# Altium schematic sheet 3_wiring drawing.SchDoc: IGON & KL15
size A2; ApprovedBy: Approved By; CheckedBy: Sky Ma; DrawnBy: JACK; Address1: 1; Address2: 2; Address3: 3; Address4: 4; DocumentNumber: 04-TE-42-4015-0PA-A; Revision: B; SheetNumber: 4; SheetTotal: 6; SheetSize: A2; CheckedByDate: 2022-12-5; DrawByDate: 2022-12-5; SiteName: EMS TD Huangpu; ProjectName: 19205_BMW CCU DDR PCBA FT fixture wiring
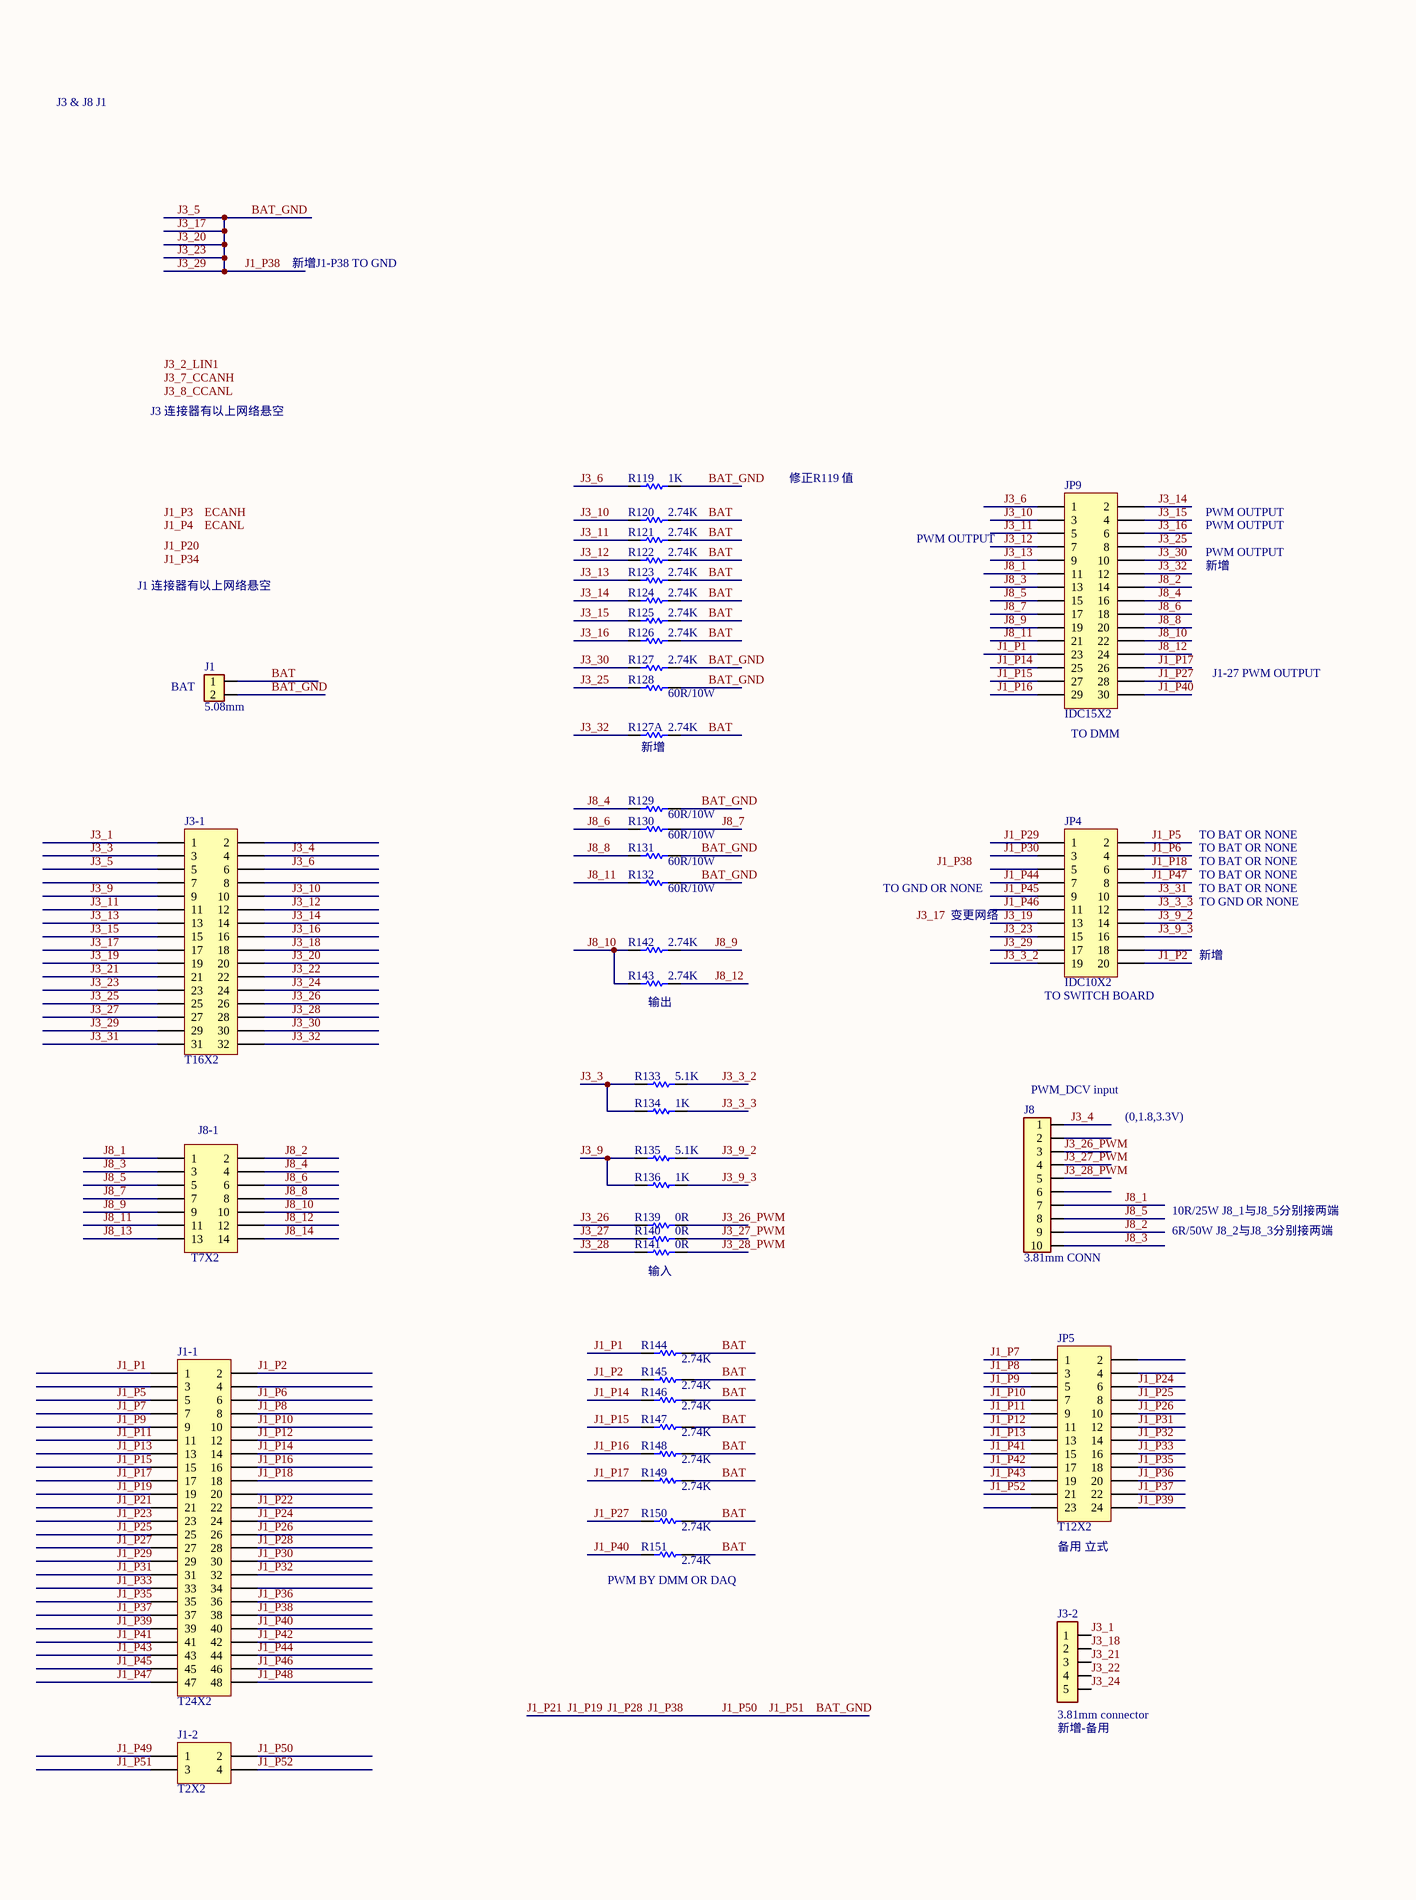
[diagram p0: 3_wiring drawing.SchDoc, left]
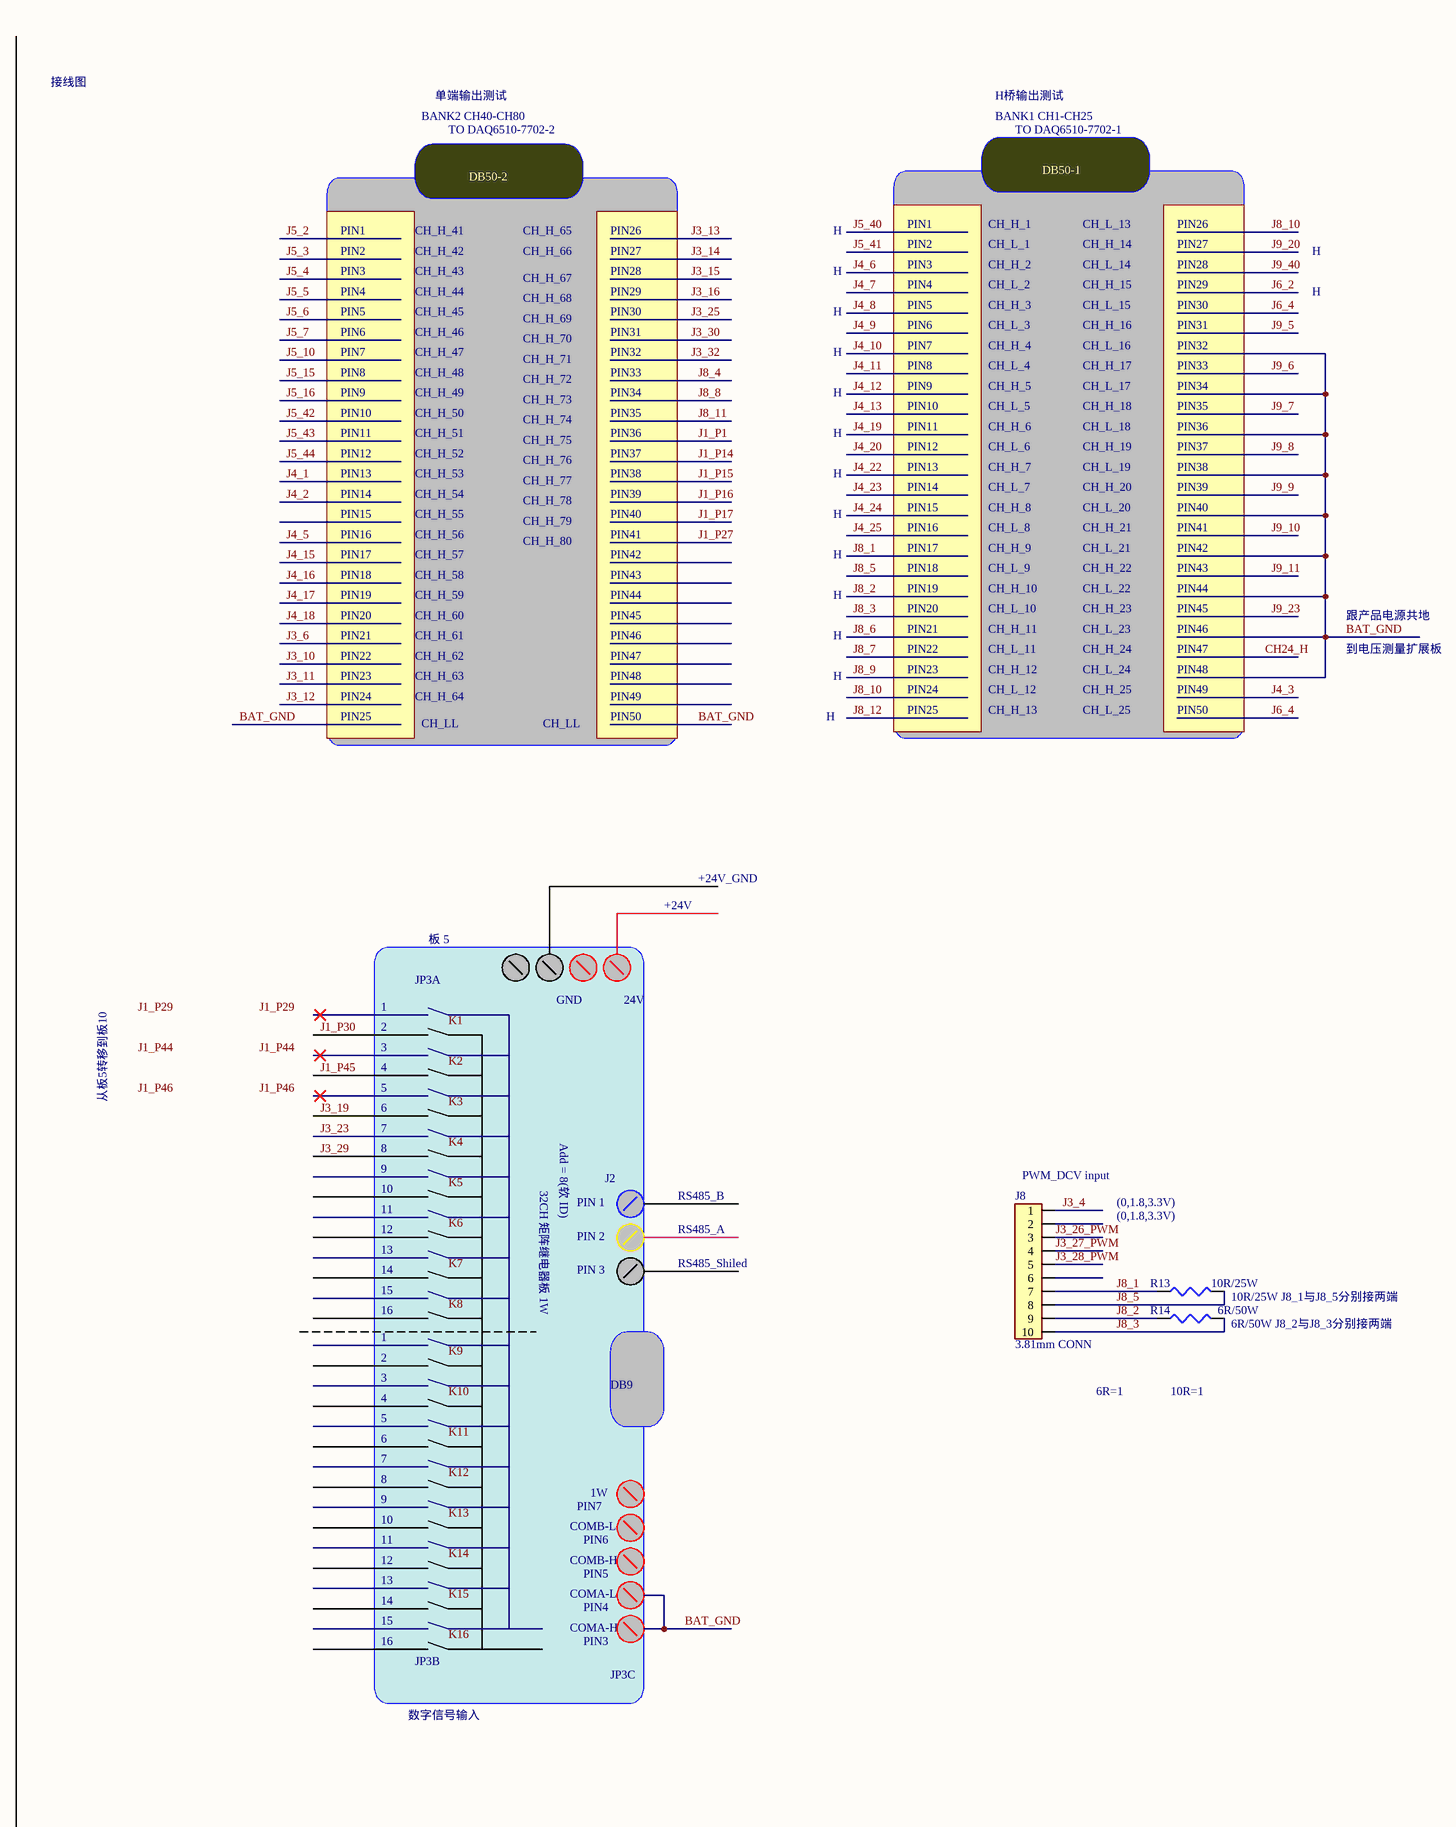
[diagram p1: 3_wiring drawing.SchDoc, right]

## Parts
(Parts that share a designator on the sheet are numbered #1, #2 ... from top to bottom, then left to right.)
J1  5.08mm  [3.81mm-2]
J1-1  T24X2  [T24X2-bend]
J1-2  T2X2  [T2X2-bend]
J3-1  T16X2  [T16X2-bend]
J3-2  3.81mm connector  [3.81mm-5-Bend]
J8#1  3.81mm CONN  [3.81mm-10]
J8#2  3.81mm CONN  [3.81mm-10]
J8-1  T7X2  [T7X2-bend]
JP4  IDC10X2  [IDC20]
JP5  T12X2  [T12X2-bend]
JP9  IDC15X2  [IDC30]
R13  10R/25W  [R AXIAL0.4]
R14  6R/50W  [R AXIAL0.4]
R119  1K  [AXIAL-0.25W]
R120  2.74K  [AXIAL-0.25W]
R121  2.74K  [AXIAL-0.25W]
R122  2.74K  [AXIAL-0.25W]
R123  2.74K  [AXIAL-0.25W]
R124  2.74K  [AXIAL-0.25W]
R125  2.74K  [AXIAL-0.25W]
R126  2.74K  [AXIAL-0.25W]
R127  2.74K  [AXIAL-0.25W]
R127A  2.74K  [AXIAL-0.25W]
R128  60R/10W  [立式10W]
R129  60R/10W  [立式10W]
R130  60R/10W  [立式10W]
R131  60R/10W  [立式10W]
R132  60R/10W  [立式10W]
R133  5.1K  [AXIAL-0.25W]
R134  1K  [AXIAL-0.25W]
R135  5.1K  [AXIAL-0.25W]
R136  1K  [AXIAL-0.25W]
R139  0R  [AXIAL-0.25W]
R140  0R  [AXIAL-0.25W]
R141  0R  [AXIAL-0.25W]
R142  2.74K  [AXIAL-0.25W]
R143  2.74K  [AXIAL-0.25W]
R144  2.74K  [AXIAL-0.25W]
R145  2.74K  [AXIAL-0.25W]
R146  2.74K  [AXIAL-0.25W]
R147  2.74K  [AXIAL-0.25W]
R148  2.74K  [AXIAL-0.25W]
R149  2.74K  [AXIAL-0.25W]
R150  2.74K  [AXIAL-0.25W]
R151  2.74K  [AXIAL-0.25W]

## Nets
BAT: J1.1 R120.2 R121.2 R122.2 R123.2 R124.2 R125.2 R126.2 R127A.2 R144.2 R145.2 R146.2 R147.2 R148.2 R149.2 R150.2 R151.2
BAT_GND: J1.2 J1-1.19 J1-1.21 J1-1.28 J1-1.38 J1-2.2 J1-2.3 J3-1.5 J3-1.17 J3-1.20 J3-1.23 J3-1.29 JP4.15 JP4.17 R119.2 R127.2 R128.2 R129.2 R131.2 R132.2  [also labelled J1_P19, J1_P21, J1_P28, J1_P38, J1_P50, J1_P51, J3_17, J3_20, J3_23, J3_29, J3_5]
J1_P1: J1-1.1 JP9.23 R144.1
J1_P2: J1-1.2 JP4.20 R145.1
J1_P5: J1-1.5 JP4.2
J1_P6: J1-1.6 JP4.4
J1_P7: J1-1.7 JP5.1
J1_P8: J1-1.8 JP5.3
J1_P9: J1-1.9 JP5.5
J1_P10: J1-1.10 JP5.7
J1_P11: J1-1.11 JP5.9
J1_P12: J1-1.12 JP5.11
J1_P13: J1-1.13 JP5.13
J1_P14: J1-1.14 JP9.25 R146.1
J1_P15: J1-1.15 JP9.27 R147.1
J1_P16: J1-1.16 JP9.29 R148.1
J1_P17: J1-1.17 JP9.26 R149.1
J1_P18: J1-1.18 JP4.6
J1_P22: J1-1.22
J1_P23: J1-1.23
J1_P24: J1-1.24 JP5.6
J1_P25: J1-1.25 JP5.8
J1_P26: J1-1.26 JP5.10
J1_P27: J1-1.27 JP9.28 R150.1
J1_P29: J1-1.29 JP4.1
J1_P30: J1-1.30 JP4.3
J1_P31: J1-1.31 JP5.12
J1_P32: J1-1.32 JP5.14
J1_P33: J1-1.33 JP5.16
J1_P35: J1-1.35 JP5.18
J1_P36: J1-1.36 JP5.20
J1_P37: J1-1.37 JP5.22
J1_P39: J1-1.39 JP5.24
J1_P40: J1-1.40 JP9.30 R151.1
J1_P41: J1-1.41 JP5.15
J1_P42: J1-1.42 JP5.17
J1_P43: J1-1.43 JP5.19
J1_P44: J1-1.44 JP4.7
J1_P45: J1-1.45 JP4.9
J1_P46: J1-1.46 JP4.11
J1_P47: J1-1.47 JP4.8
J1_P48: J1-1.48
J1_P49: J1-2.1
J1_P52: J1-2.4 JP5.21
J3_1: J3-1.1 J3-2.1
J3_3: J3-1.3 R133.1 R134.1
J3_3_2: JP4.19 R133.2
J3_3_3: JP4.12 R134.2
J3_4: J3-1.4 J8#1.1 J8#2.1
J3_6: J3-1.6 JP9.1 R119.1
J3_9: J3-1.9 R135.1 R136.1
J3_9_2: JP4.14 R135.2
J3_9_3: JP4.16 R136.2
J3_10: J3-1.10 JP9.3 R120.1
J3_11: J3-1.11 JP9.5 R121.1
J3_12: J3-1.12 JP9.7 R122.1
J3_13: J3-1.13 JP9.9 R123.1
J3_14: J3-1.14 JP9.2 R124.1
J3_15: J3-1.15 JP9.4 R125.1
J3_16: J3-1.16 JP9.6 R126.1
J3_18: J3-1.18 J3-2.2
J3_19: J3-1.19 JP4.13
J3_21: J3-1.21 J3-2.3
J3_22: J3-1.22 J3-2.4
J3_24: J3-1.24 J3-2.5
J3_25: J3-1.25 JP9.8 R128.1
J3_26: J3-1.26 R139.1
J3_26_PWM: J8#1.3 J8#2.3 R139.2
J3_27: J3-1.27 R140.1
J3_27_PWM: J8#1.4 J8#2.4 R140.2
J3_28: J3-1.28 R141.1
J3_28_PWM: J8#1.5 J8#2.5 R141.2
J3_30: J3-1.30 JP9.10 R127.1
J3_31: J3-1.31 JP4.10
J3_32: J3-1.32 JP9.12 R127A.1
J8_1: J8#1.7 J8#2.7 J8-1.1 JP9.11 R13.1
J8_2: J8#1.9 J8#2.9 J8-1.2 JP9.14 R14.1
J8_3: J8#1.10 J8#2.10 J8-1.3 JP9.13 R14.2
J8_4: J8-1.4 JP9.16 R129.1
J8_5: J8#1.8 J8#2.8 J8-1.5 JP9.15 R13.2
J8_6: J8-1.6 JP9.18 R130.1
J8_7: J8-1.7 JP9.17 R130.2
J8_8: J8-1.8 JP9.20 R131.1
J8_9: J8-1.9 JP9.19 R142.2
J8_10: J8-1.10 JP9.22 R142.1 R143.1
J8_11: J8-1.11 JP9.21 R132.1
J8_12: J8-1.12 JP9.24 R143.2
J8_13: J8-1.13
J8_14: J8-1.14

Not connected (* = marked no-connect by the designer): J1-1 3 4 20 34; J3-1 2 7 8; J8#1 2 6; J8#2 2 6; JP4 5 18; JP5 2 4 23

## Notes on the sheet
- J3 & J8 J1
- 接线图
- BANK2 CH40-CH80
- 单端输出测试
- TO DAQ6510-7702-2
- H桥输出测试
- BANK1 CH1-CH25
- TO DAQ6510-7702-1
- DB50-2
- DB50-1
- PIN1
- PIN2
- CH_H_41
- CH_H_42
- CH_H_65
- CH_H_66
- PIN26
- PIN27
- H
- PIN3
- CH_H_1
- CH_H_2
- CH_L_1
- CH_H_14
- CH_L_13
- CH_L_14
- PIN28
- 新增J1-P38 TO GND
- PIN4
- PIN5
- CH_H_43
- CH_H_44
- CH_H_45
- CH_H_67
- CH_H_68
- CH_H_69
- PIN29
- PIN30
- PIN6
- CH_H_3
- CH_L_2
- CH_L_3
- CH_H_15
- CH_H_16
- CH_L_15
- PIN31
- PIN7
- PIN8
- PIN9
- CH_H_46
- CH_H_47
- CH_H_48
- CH_H_49
- CH_H_70
- CH_H_71
- CH_H_72
- CH_H_73
- PIN32
- PIN33
- PIN34
- CH_H_4
- CH_H_5
- CH_L_4
- CH_H_17
- CH_L_16
- CH_L_17
- J3 连接器有以上网络悬空
- PIN10
- PIN11
- PIN12
- CH_H_50
- CH_H_51
- CH_H_52
- CH_H_74
- CH_H_75
- CH_H_76
- PIN35
- PIN36
- PIN37
- CH_H_6
- CH_L_5
- CH_L_6
- CH_H_18
- CH_H_19
- CH_L_18
- 修正R119 值
- PWM OUTPUT
- PIN13
- PIN14
- PIN15
- PIN16
- CH_H_53
- CH_H_54
- CH_H_55
- CH_H_56
- CH_H_77
- CH_H_78
- CH_H_79
- PIN38
- PIN39
- PIN40
- PIN41
- CH_H_7
- CH_H_8
- CH_L_7
- CH_L_8
- CH_H_20
- CH_H_21
- CH_L_19
- CH_L_20
- J1 连接器有以上网络悬空
- 新增
- PIN17
- PIN18
- PIN19
- CH_H_57
- CH_H_58
- CH_H_59
- CH_H_80
- PIN42
- PIN43
- PIN44
- CH_H_9
- CH_H_10
- CH_L_9
- CH_H_22
- CH_L_21
- CH_L_22
- PIN20
- PIN21
- PIN22
- CH_H_60
- CH_H_61
- CH_H_62
- PIN45
- PIN46
- PIN47
- PIN23
- CH_H_11
- CH_H_12
- CH_L_10
- CH_L_11
- CH_H_23
- CH_H_24
- CH_L_23
- CH_L_24
- PIN48
- 跟产品电源共地
- 到电压测量扩展板
- (near J1) BAT
- J1-27 PWM OUTPUT
- PIN24
- PIN25
- CH_H_63
- CH_H_64
- CH_LL
- PIN49
- PIN50
- CH_H_13
- CH_L_12
- CH_H_25
- CH_L_25
- (near R127A) 新增
- (near JP9) TO DMM
- TO BAT OR NONE
- TO GND OR NONE
- 变更网络
- 板 5
- +24V
- +24V_GND
- JP3A
- GND
- 24V
- (near R143) 输出
- (near JP4) TO SWITCH BOARD
- 1
- 2
- 3
- 4
- (near J8#1) PWM_DCV input
- (0,1.8,3.3V)
- 从板5转移到板10
- 5
- 6
- 7
- Add = 8(软 ID)
- 8
- 9
- 10
- 11
- 32CH 矩阵继电器板 1W
- PIN 1
- J2
- RS485_B
- (near J8#2) PWM_DCV input
- 10R/25W J8_1与J8_5分别接两端
- 6R/50W J8_2与J8_3分别接两端
- 12
- 13
- 14
- PIN 2
- PIN 3
- RS485_A
- RS485_Shiled
- (near R141) 输入
- 15
- 16
- DB9
- 6R=1
- 10R=1
- COMB-L
- 1W
- (near R151) PWM BY DMM OR DAQ
- (near JP5) 备用 立式
- COMB-H
- COMA-L
- JP3B
- COMA-H
- JP3C
- (near J3-2) 新增-备用
- 数字信号输入
- Labels drawn without touching a wire or pin: ECANH, ECANL, J1_P3, J1_P4, J1_P20, J1_P29, J1_P30, J1_P34, J1_P38, J1_P44, J1_P45, J1_P46, J3_2_LIN1, J3_7_CCANH, J3_8_CCANL, J3_17, J3_19, J3_23, J3_29, K1, K2, K3, K4, K5, K6, K7, K8, K9, K10, K11, K12, K13, K14, K15, K16
- Document Number:
- Rev:
- Project Name:
- Drawn By:
- Date:
- Titile:
- Checked By:
- Sheet:
- Of

## Library data of the parts
J1 = CON2-3.81
J3-2 = CON5-3.81
J8#1 J8#2 = CON10-3.81
J8-1 = IDC7X2
R13 R14 = RES2
R119-R127 R127A R128-R136 R139-R151 = RES1